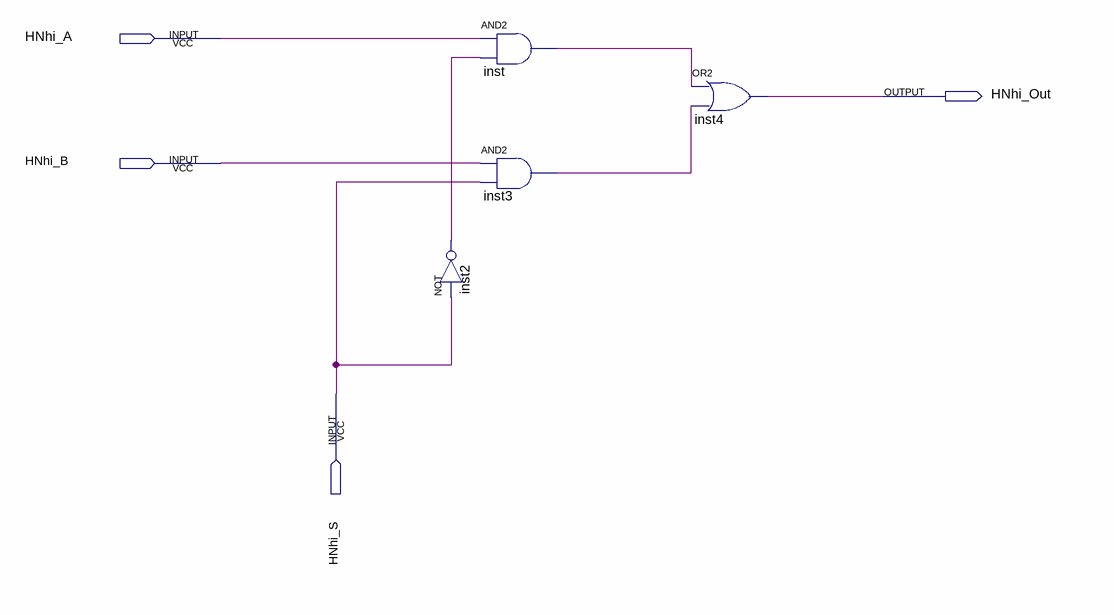
[diagram p0: schematic sheet]
// Quartus schematic mul2_1_1.bdf as structural Verilog: 4 symbols, 4 pins
module mul2_1_1 (
  input  HNhi_A,
  input  HNhi_B,
  input  HNhi_S,
  output HNhi_Out
);

  wire inst2_out, inst3_out, inst_out;

  not inst2 (inst2_out, HNhi_S);
  and inst (inst_out, HNhi_A, inst2_out);
  and inst3 (inst3_out, HNhi_B, HNhi_S);
  or inst4 (HNhi_Out, inst_out, inst3_out);
endmodule
